# Altium schematic sheet CAN_TJA1050.SchDoc
size A4
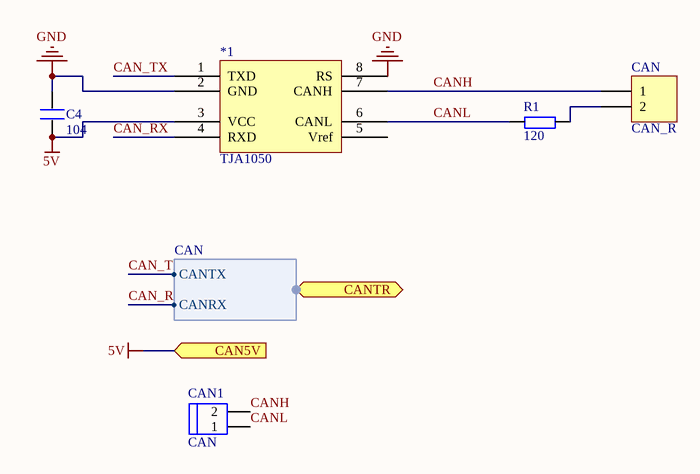
[diagram p0: CAN_TJA1050.SchDoc]

## Parts
*1  TJA1050  [SOP8]
C4  104  [0603P]
CAN  CAN_R  [HDR1X2]
CAN1  CAN  [HEAD2L-0.8]
R1  120  [0603P]

## Ports
CAN5V (in), CANTR (harness CAN)

## Harnesses
CAN: CANTX, CANRX

## Nets
5V: *1.3(VCC) C4.1 ; port CAN5V
GND: *1.2(GND) *1.8(RS) C4.2
CAN_RX: *1.4(RXD) ; port CANTR.CANRX
CAN_TX: *1.1(TXD) ; port CANTR.CANTX
CANH: *1.7(CANH) CAN.1 CAN1.2
CANL: *1.6(CANL) CAN1.1 R1.1
NetCAN_2: CAN.2 R1.2

Not connected (* = marked no-connect by the designer): *1 5(Vref)

## Library data of the parts
C4 = C
CAN = Header 2: Header, 2-Pin; LatestRevisionDate: 17-Jul-2002; LatestRevisionNote: Re-released for DXP Platform.; Publisher: Altium Limited
CAN1 = HEAD2
R1 = R